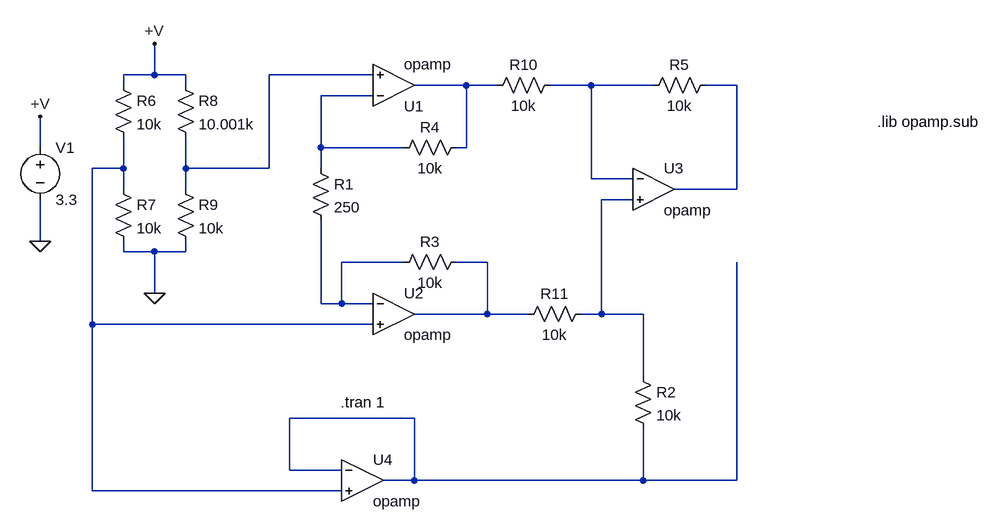
[diagram p0: schematic amp00.asc]
amp00.asc, the LTspice schematic file:
Version 4
SHEET 1 1124 732
WIRE -160 -128 -160 -176
WIRE -160 -128 -208 -128
WIRE -112 -128 -160 -128
WIRE 176 -128 16 -128
WIRE -208 -112 -208 -128
WIRE -112 -112 -112 -128
WIRE 320 -112 240 -112
WIRE 368 -112 320 -112
WIRE 512 -112 448 -112
WIRE 608 -112 512 -112
WIRE 736 -112 688 -112
WIRE 176 -96 96 -96
WIRE -336 -16 -336 -64
WIRE 96 -16 96 -96
WIRE 224 -16 96 -16
WIRE 320 -16 320 -112
WIRE 320 -16 304 -16
WIRE -208 16 -208 -32
WIRE -208 16 -256 16
WIRE -112 16 -112 -32
WIRE 16 16 16 -128
WIRE 16 16 -112 16
WIRE 96 16 96 -16
WIRE 512 32 512 -112
WIRE 576 32 512 32
WIRE -208 48 -208 16
WIRE -112 48 -112 16
WIRE 736 48 736 -112
WIRE 736 48 640 48
WIRE 576 64 528 64
WIRE -336 128 -336 64
WIRE -208 144 -208 128
WIRE -160 144 -208 144
WIRE -112 144 -112 128
WIRE -112 144 -160 144
WIRE 224 160 128 160
WIRE 352 160 304 160
WIRE -160 208 -160 144
WIRE 96 224 96 96
WIRE 128 224 128 160
WIRE 128 224 96 224
WIRE 176 224 128 224
WIRE 352 240 352 160
WIRE 352 240 240 240
WIRE 416 240 352 240
WIRE 528 240 528 64
WIRE 528 240 496 240
WIRE 592 240 528 240
WIRE -256 256 -256 16
WIRE 176 256 -256 256
WIRE 592 336 592 240
WIRE 240 400 48 400
WIRE 48 480 48 400
WIRE 128 480 48 480
WIRE 240 496 240 400
WIRE 240 496 192 496
WIRE 592 496 592 416
WIRE 592 496 240 496
WIRE 736 496 736 160
WIRE 736 496 592 496
WIRE -256 512 -256 256
WIRE 128 512 -256 512
WIRE 0 0 0 0
FLAG -336 -64 +V
FLAG -336 128 0
FLAG -160 208 0
FLAG -160 -176 +V
SYMBOL res 80 0 R0
SYMATTR InstName R1
SYMATTR Value 250
SYMBOL res 576 320 R0
SYMATTR InstName R2
SYMATTR Value 10k
SYMBOL res 320 144 R90
WINDOW 0 0 56 VBottom 2
WINDOW 3 32 56 VTop 2
SYMATTR InstName R3
SYMATTR Value 10k
SYMBOL res 320 -32 R90
WINDOW 0 0 56 VBottom 2
WINDOW 3 32 56 VTop 2
SYMATTR InstName R4
SYMATTR Value 10k
SYMBOL res 704 -128 R90
WINDOW 0 0 56 VBottom 2
WINDOW 3 32 56 VTop 2
SYMATTR InstName R5
SYMATTR Value 10k
SYMBOL voltage -336 -32 R0
WINDOW 123 0 0 Left 2
WINDOW 39 0 0 Left 2
SYMATTR InstName V1
SYMATTR Value 3.3
SYMBOL res -224 -128 R0
SYMATTR InstName R6
SYMATTR Value 10k
SYMBOL res -224 32 R0
SYMATTR InstName R7
SYMATTR Value 10k
SYMBOL res -128 -128 R0
SYMATTR InstName R8
SYMATTR Value 10.001k
SYMBOL res -128 32 R0
SYMATTR InstName R9
SYMATTR Value 10k
SYMBOL res 464 -128 R90
WINDOW 0 0 56 VBottom 2
WINDOW 3 32 56 VTop 2
SYMATTR InstName R10
SYMATTR Value 10k
SYMBOL res 512 224 R90
WINDOW 0 0 56 VBottom 2
WINDOW 3 32 56 VTop 2
SYMATTR InstName R11
SYMATTR Value 10k
SYMBOL Opamps\\opamp 208 -48 M180
SYMATTR InstName U1
SYMATTR SpiceLine Aol=1000K
SYMBOL Opamps\\opamp 208 176 R0
SYMATTR InstName U2
SYMATTR SpiceLine Aol=1000K
SYMBOL Opamps\\opamp 608 -16 R0
SYMATTR InstName U3
SYMATTR SpiceLine Aol=1000K
SYMBOL Opamps\\opamp 160 432 R0
SYMATTR InstName U4
SYMATTR SpiceLine Aol=1000K
TEXT 126 376 Left 2 !.tran 1
TEXT 952 -56 Left 2 !.lib opamp.sub

The netlist it stands for:
* amp00.asc
R1 N005 N008 250
R2 N007 N010 10k
R3 N009 N008 10k
R4 N002 N005 10k
R5 N004 N003 10k
V1 +V 0 3.3
R6 +V N006 10k
R7 N006 0 10k
R8 +V N001 10.001k
R9 N001 0 10k
R10 N003 N002 10k
R11 N007 N009 10k
XU1 N005 N001 N002 opamp Aol=1000K GBW=10Meg  ; pins invin noninvin out
XU2 N008 N006 N009 opamp Aol=1000K GBW=10Meg  ; pins invin noninvin out
XU3 N003 N007 N004 opamp Aol=1000K GBW=10Meg  ; pins invin noninvin out
XU4 N010 N006 N010 opamp Aol=1000K GBW=10Meg  ; pins invin noninvin out
.tran 1
.lib opamp.sub
.backanno
.end